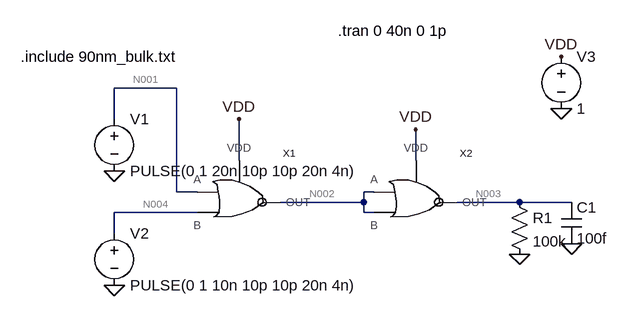
[diagram p0: schematic 1_exp2.asc]
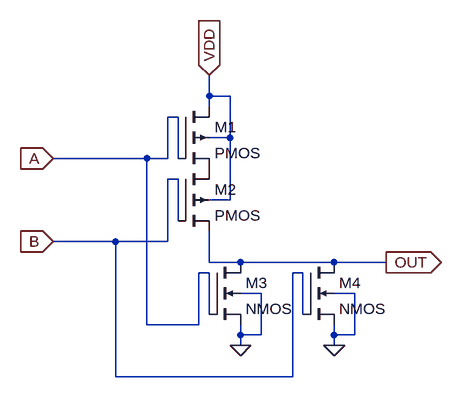
[diagram p1: sub-circuit nor.asc]
1_exp2.asc, the LTspice schematic file:
Version 4
SHEET 1 880 680
WIRE 64 -32 -32 -32
WIRE -32 16 -32 -32
WIRE 160 80 160 16
WIRE 432 80 432 32
WIRE 64 128 64 -32
WIRE 96 128 64 128
WIRE 368 128 352 128
WIRE 352 144 352 128
WIRE 352 144 224 144
WIRE 592 144 496 144
WIRE 672 144 592 144
WIRE 96 160 -32 160
WIRE 352 160 352 144
WIRE 368 160 352 160
WIRE -32 192 -32 160
FLAG -32 272 0
FLAG -32 96 0
FLAG 160 16 VDD
FLAG 432 32 VDD
FLAG 592 224 0
FLAG 672 208 0
FLAG 656 0 0
FLAG 656 -80 VDD
SYMBOL nor 160 144 R0
SYMATTR InstName X1
SYMBOL voltage -32 0 R0
WINDOW 123 0 0 Left 2
WINDOW 39 0 0 Left 2
SYMATTR InstName V1
SYMATTR Value PULSE(0 1 20n 10p 10p 20n 4n)
SYMBOL voltage -32 176 R0
WINDOW 123 0 0 Left 2
WINDOW 39 0 0 Left 2
SYMATTR InstName V2
SYMATTR Value PULSE(0 1 10n 10p 10p 20n 4n)
SYMBOL nor 432 144 R0
SYMATTR InstName X2
SYMBOL res 576 128 R0
SYMATTR InstName R1
SYMATTR Value 100k
SYMBOL cap 656 144 R0
SYMATTR InstName C1
SYMATTR Value 100f
SYMBOL voltage 656 -96 R0
WINDOW 123 0 0 Left 2
WINDOW 39 0 0 Left 2
SYMATTR InstName V3
SYMATTR Value 1
TEXT -176 -80 Left 2 !.include 90nm_bulk.txt
TEXT 312 -120 Left 2 !.tran 0 40n 0 1p

nor.asc, the sub-circuit schematic file:
Version 4
SHEET 1 880 680
WIRE 352 0 352 -32
WIRE 384 0 352 0
WIRE 352 16 352 0
WIRE 304 32 288 32
WIRE 384 64 384 0
WIRE 384 64 352 64
WIRE 256 96 112 96
WIRE 288 96 288 32
WIRE 288 96 256 96
WIRE 304 96 304 32
WIRE 304 128 288 128
WIRE 384 160 384 64
WIRE 384 160 352 160
WIRE 304 192 304 128
WIRE 208 224 112 224
WIRE 288 224 288 128
WIRE 288 224 208 224
WIRE 352 256 352 208
WIRE 400 256 352 256
WIRE 544 256 400 256
WIRE 624 256 544 256
WIRE 352 272 336 272
WIRE 496 272 480 272
WIRE 432 304 400 304
WIRE 576 304 544 304
WIRE 352 336 352 272
WIRE 496 336 496 272
WIRE 256 352 256 96
WIRE 336 352 336 272
WIRE 336 352 256 352
WIRE 400 368 400 352
WIRE 432 368 432 304
WIRE 432 368 400 368
WIRE 544 368 544 352
WIRE 576 368 576 304
WIRE 576 368 544 368
WIRE 400 384 400 368
WIRE 544 384 544 368
WIRE 208 432 208 224
WIRE 480 432 480 272
WIRE 480 432 208 432
FLAG 352 -32 VDD
IOPIN 352 -32 In
FLAG 400 384 0
FLAG 544 384 0
FLAG 624 256 OUT
IOPIN 624 256 Out
FLAG 112 96 A
IOPIN 112 96 In
FLAG 112 224 B
IOPIN 112 224 In
SYMBOL pmos4 304 16 R0
SYMATTR InstName M1
SYMATTR Value2 l=90n w=400n
SYMBOL pmos4 304 112 R0
SYMATTR InstName M2
SYMATTR Value2 l=90n w=400n
SYMBOL nmos4 352 256 R0
SYMATTR InstName M3
SYMATTR Value2 l=90n w=200n
SYMBOL nmos4 496 256 R0
SYMATTR InstName M4
SYMATTR Value2 l=90n w=200n

The netlist it stands for:
* 1_exp2.asc
XX1 N001 N004 N002 VDD nor
V1 N001 0 PULSE(0 1 20n 10p 10p 20n 4n)
V2 N004 0 PULSE(0 1 10n 10p 10p 20n 4n)
XX2 N002 N002 N003 VDD nor
R1 N003 0 100k
C1 N003 0 100f
V3 VDD 0 1

* block symbol definitions
.subckt nor A B OUT VDD
M1 VDD A P001 VDD PMOS l=90n w=400n
M2 P001 B OUT VDD PMOS l=90n w=400n
M3 OUT A 0 0 NMOS l=90n w=200n
M4 OUT B 0 0 NMOS l=90n w=200n
.ends nor

.model NMOS NMOS
.model PMOS PMOS
.lib standard.mos
.include 90nm_bulk.txt
.tran 0 40n 0 1p
.backanno
.end

* Results of the author's LTspice run, read from the files saved beside the schematic
* Operating Point, zero values left out:
*   V(vdd) = 1 V
*   V(n002) = 999.9 mV
*   V(n003) = 663.4 nV
*   I(R1) = 6.634 pA
*   I(V3) = -11.94 nA
*   I(V2) = 130.9 pA
*   I(V1) = 130.9 pA
*   Ix(x1:A) = -130.9 pA
*   Ix(x1:B) = -130.9 pA
*   Ix(x1:OUT) = -1.098 nA
*   Ix(x1:VDD) = 11.58 nA
*   Ix(x2:A) = 548.3 pA
*   Ix(x2:B) = 549.7 pA
*   Ix(x2:OUT) = -6.708 pA
*   Ix(x2:VDD) = 358.4 pA
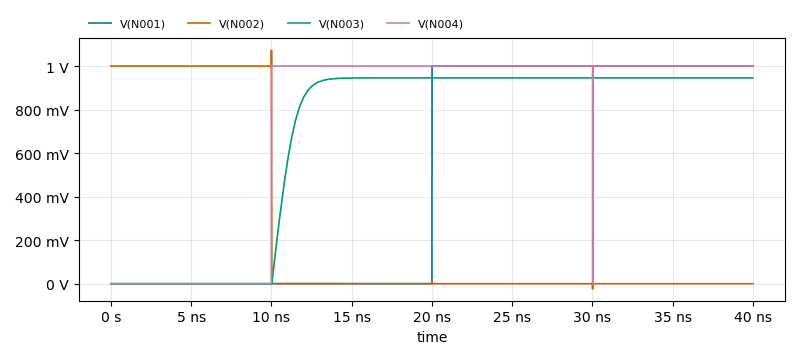
[diagram p2: Transient Analysis of 1_exp2.asc, plotted from the saved traces]
* Transient Analysis, 1 run:
*   V(N001): min 0 V, max 1 V, average 499.9 mV, rms 707 mV, last 1 V
*   V(N002): min -23.35 mV, max 1.072 V, average 250.5 mV, rms 500.3 mV, last 553.1 nV
*   V(N003): min -3.105 mV, max 945.8 mV, average 686 mV, rms 799.9 mV, last 945.6 mV
*   V(N004): min 0 V, max 1 V, average 749.6 mV, rms 865.7 mV, last 1 V